# EAGLE schematic circuit steppermotor (EAGLE 9.6.2)
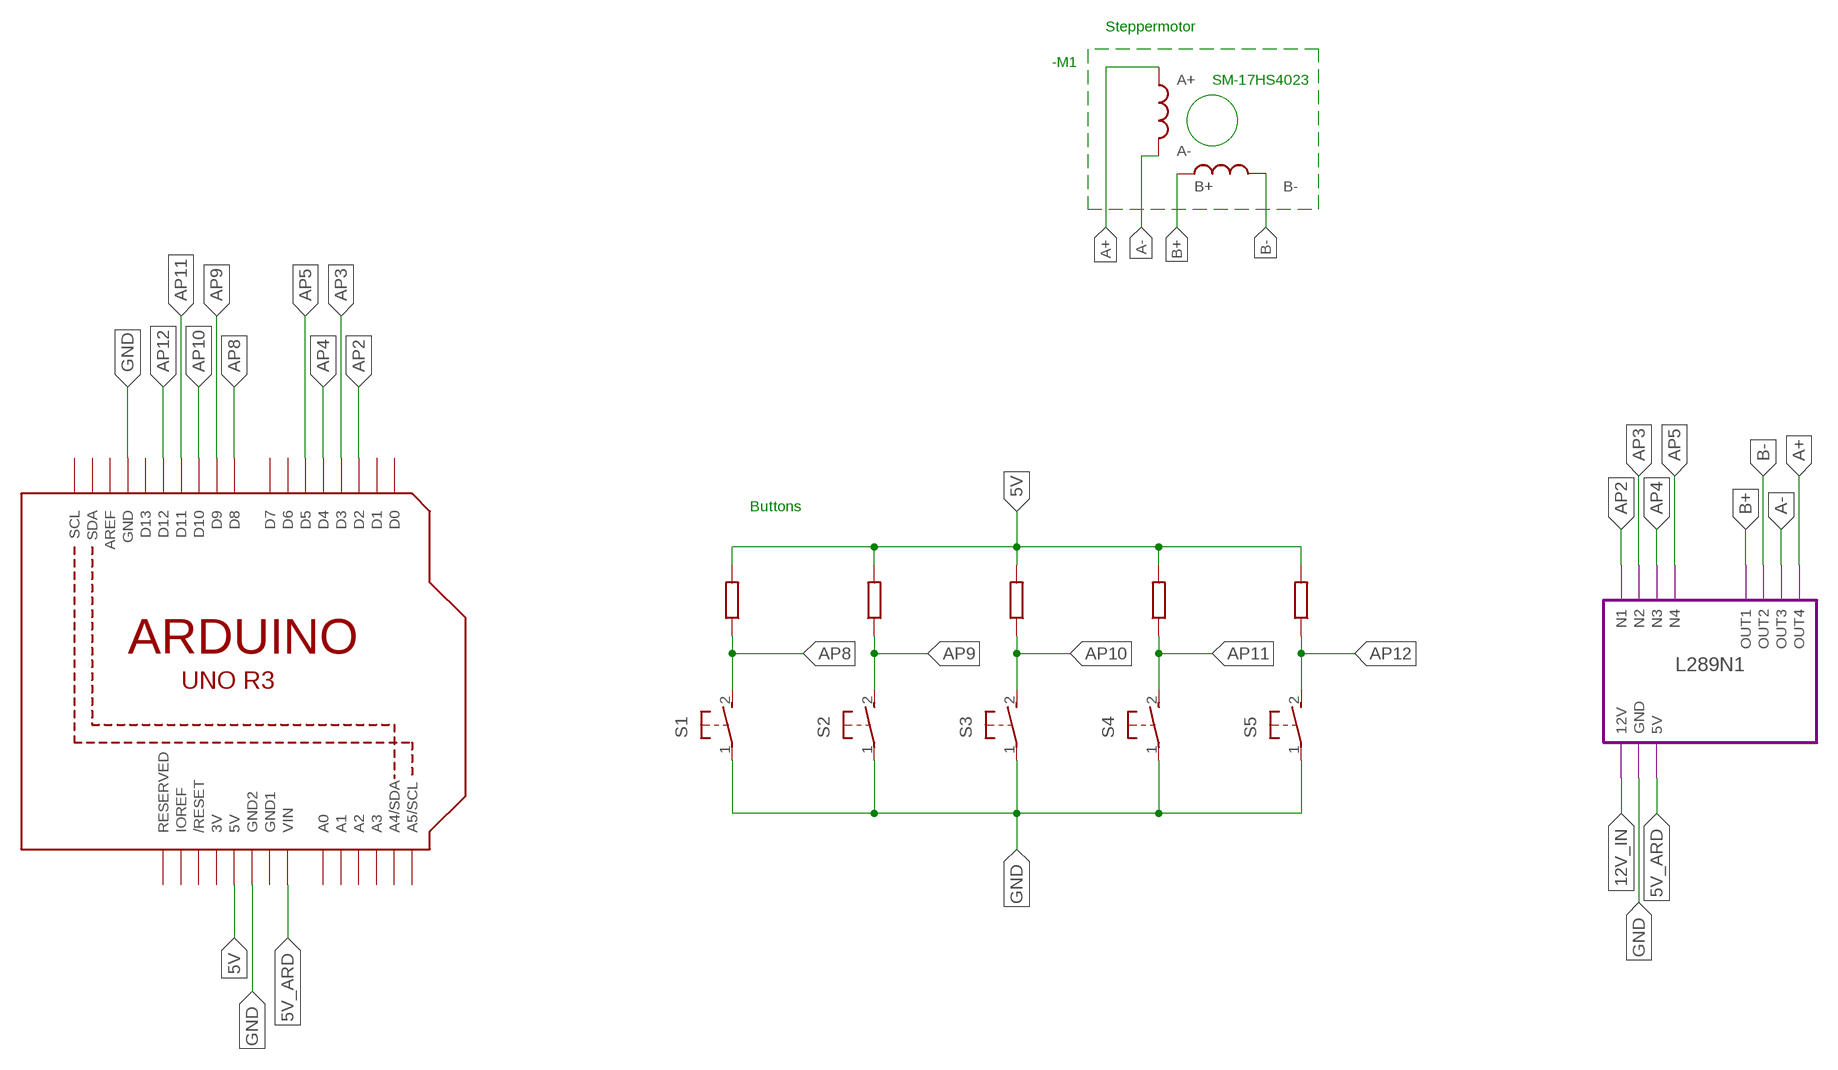
[diagram p0: schematic, sheet 1]

## Parts
L1  L_CHIP(4509-METRIC)  [INDC4509X190]
L2  L_CHIP(4509-METRIC)  [INDC4509X190]
S1  31-XX  [B3F-31XX]
S2  31-XX  [B3F-31XX]
S3  31-XX  [B3F-31XX]
S4  31-XX  [B3F-31XX]
S5  31-XX  [B3F-31XX]
U2  ARDUINOR3-DIMENSION  [ARDUINOR3]

## Module instances
L289N1 = L289N

## Nets
5V: U2.5V
5V_ARD: U2.VIN ; port L289N1.5V
12V_IN: port L289N1.12V
A+: L2.1 ; port L289N1.OUT4
A-: L2.2 ; port L289N1.OUT3
AP2: U2.D2 ; port L289N1.N1
AP3: U2.D3 ; port L289N1.N2
AP4: U2.D4 ; port L289N1.N3
AP5: U2.D5 ; port L289N1.N4
AP8: S1.2(S) U2.D8
AP9: S2.2(S) U2.D9
AP10: S3.2(S) U2.D10
AP11: S4.2(S) U2.D11
AP12: S5.2(S) U2.D12
B+: L1.1 ; port L289N1.OUT1
B-: L1.2 ; port L289N1.OUT2
GND: S1.1(P) S2.1(P) S3.1(P) S4.1(P) S5.1(P) U2.GND U2.GND2 ; port L289N1.GND
Unconnected: U2.A0 U2.A1 U2.A2 U2.A3 U2.A4(A4/SDA) U2.A5(A5/SCL) U2.AREF U2.D0 U2.D1 U2.D6 U2.D7 U2.D13 U2.IOREF U2.RESERVED U2.RESET(/RESET) U2.SCL U2.SDA

## Notes on the sheet
- Steppermotor
- -M1
- SM-17HS4023
- Buttons

## Power pins joined to a net without a drawn wire
3V: U2.3V
GND1: U2.GND1

## Library data of the parts
L1 L2 = Inductor:L: Inductor Fixed - Generic; CATEGORY: Inductor; SUB-CATEGORY: Fixed
S1-S5 = switch-omron:31-XX: OMRON SWITCH; MPN: B3F-3100; OC_FARNELL: 959704; OC_NEWARK: 36M3582
U2 = adafruit:ARDUINOR3: This is a new object for the new Arduino R3 - with extra pins that you may want to use (such as IOref, and duplicated A4/A5

## Module L289N
Ports: N1(io) N2(io) N3(io) N4(io) OUT4(io) OUT3(io) OUT2(io) OUT1(io) 12V(io) GND(io) 5V(io)

### Library data of the parts